# Altium project NNLightSwitcher.PrjPcb (part 4 of 5)

## Sheet NNLightSwitcher_WirelessCharger.SchDoc
size A4
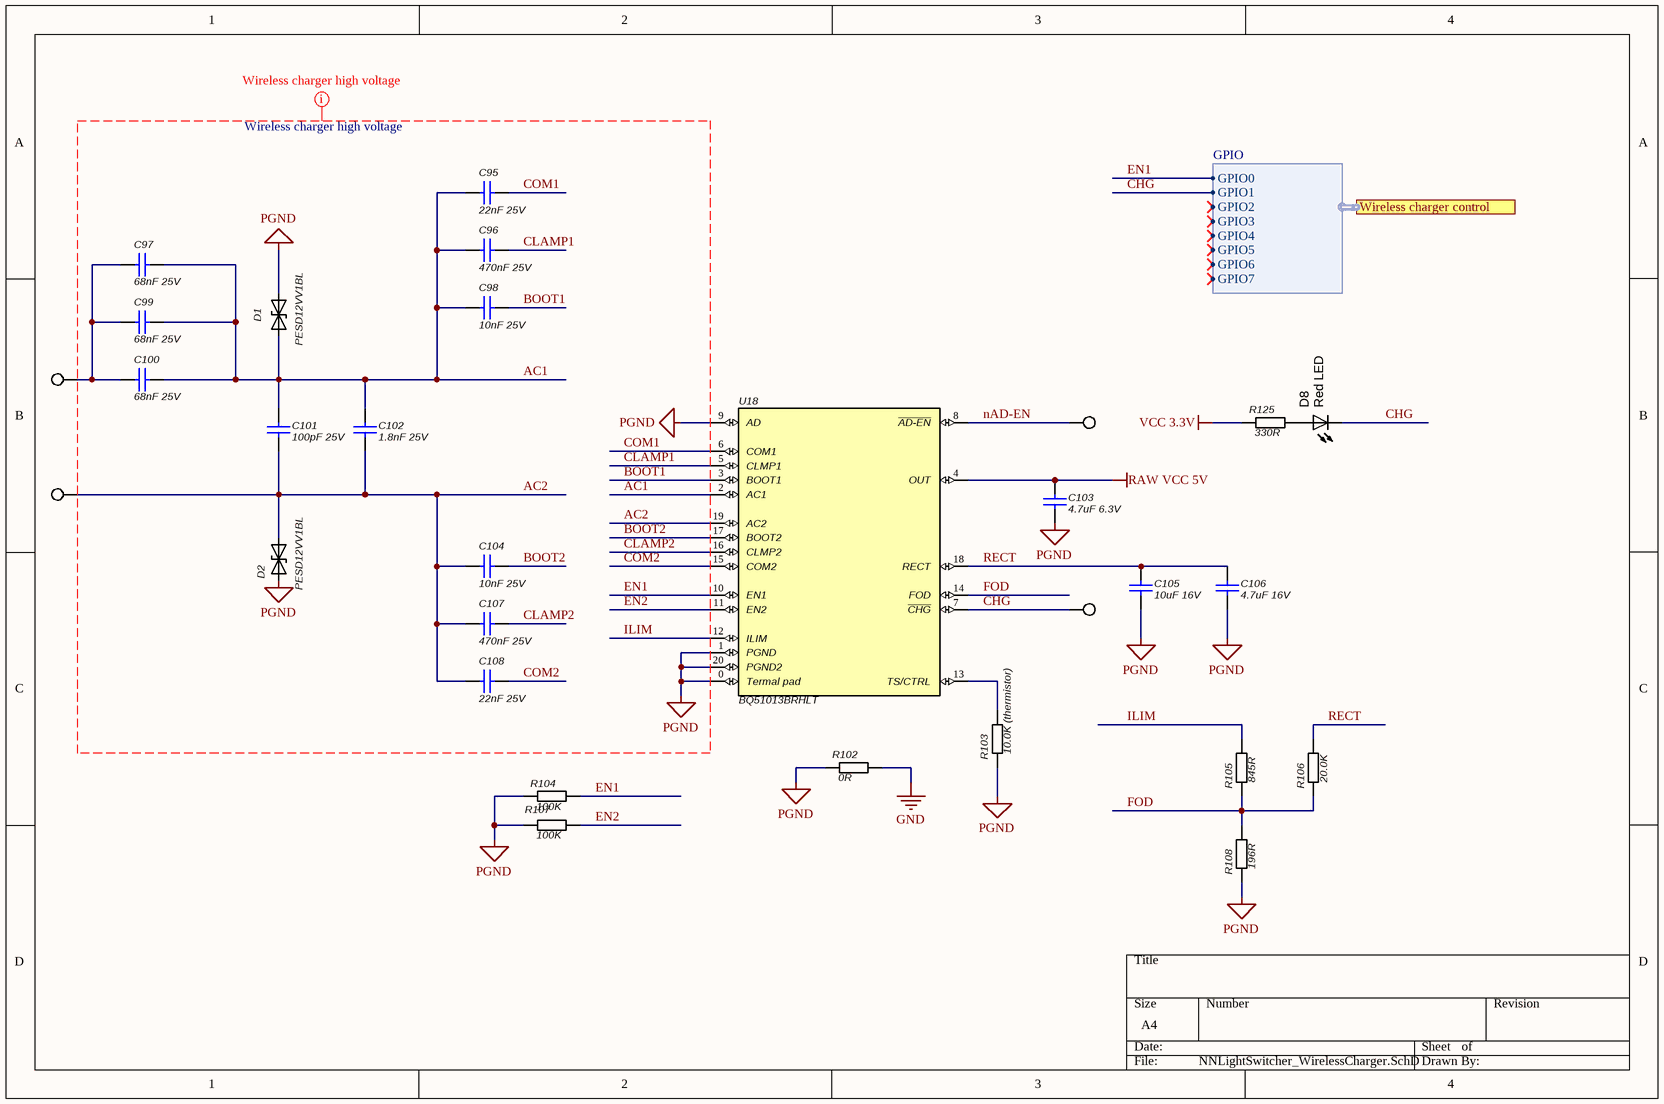
[diagram p11: NNLightSwitcher_WirelessCharger.SchDoc]

### Parts
C95  22nF 25V  [0402]
C96  470nF 25V  [0402]
C97  68nF 25V  [*0603]
C98  10nF 25V  [0402]
C99  68nF 25V  [*0603]
C100  68nF 25V  [*0603]
C101  100pF 25V  [0402]
C102  1.8nF 25V  [0402]
C103  4.7uF 6.3V  [*0603]
C104  10nF 25V  [0402]
C105  10uF 16V  [*0603]
C106  4.7uF 16V  [*0603]
C107  470nF 25V  [0402]
C108  22nF 25V  [0402]
D1  PESD12VV1BL  [*SOD882(T)]
D2  PESD12VV1BL  [*SOD882(T)]
D8  Red LED  [*LED_SML-P11UTT86R_SML-P11MTT86(Primary)]
R102  0R  [0402]
R103  10.0K (thermistor)  [0402]
R104  100K  [0402]
R105  845R  [0402]
R106  20.0K  [0402]
R107  100K  [0402]
R108  196R  [0402]
R125  330R  [0402]
TP56  Test point  [Connection]  (value not drawn)
TP57  Test point  [Testpoint_with_pad]  (value not drawn)
TP58  Test point  [Connection]  (value not drawn)
TP59  Test point  [Testpoint_Keystone_Miniature]  (value not drawn)
U18  BQ51013BRHLT  [*QFN-20(VQFN-20)]

### Ports
Wireless charger control (harness GPIO)

### Harnesses
GPIO: GPIO7, GPIO6, GPIO5, GPIO4, GPIO3, GPIO2, GPIO1, GPIO0

### Nets
GND: R102.2
PGND: C103.2 C105.1 C106.2 D1.1(K) D2.2(A) R102.1 R103.1 R104.1 R107.1 R108.1 U18.0(Termal_pad) U18.1(PGND) U18.9(AD) U18.20(PGND2)
RAW VCC 5V: C103.1 U18.4(OUT)
VCC 3.3V: R125.1
AC1: C95.2 C96.2 C97.1 C98.2 C99.1 C100.1 C101.1 C102.1 D1.2(A) U18.2(AC1)
AC2: C101.2 C102.2 C104.2 C107.2 C108.2 D2.1(K) TP58.1 U18.19(AC2)
BOOT1: C98.1 U18.3(BOOT1)
BOOT2: C104.1 U18.17(BOOT2)
CHG: D8.C TP59.1 U18.7(~{CHG}) ; port Wireless charger control.GPIO1
CLAMP1: C96.1 U18.5(CLMP1)
CLAMP2: C107.1 U18.16(CLMP2)
COM1: C95.1 U18.6(COM1)
COM2: C108.1 U18.15(COM2)
EN1: R104.2 U18.10(EN1) ; port Wireless charger control.GPIO0
EN2: R107.2 U18.11(EN2)
FOD: R105.1 R106.1 R108.2 U18.14(FOD)
ILIM: R105.2 U18.12(ILIM)
nAD-EN: TP57.1 U18.8(~{AD-EN})
RECT: C105.2 C106.1 R106.2 U18.18(RECT)
NetC97_2: C97.2 C99.2 C100.2 TP56.1
NetD8_A: D8.A R125.2
NetR103_2: R103.2 U18.13(TS/CTRL)

### Layout directives
net class Wireless charger high voltage: AC1, AC2, BOOT1, BOOT2, CLAMP1, CLAMP2, COM1, COM2, EN1, EN2, ILIM, PGND

### Library data of the parts
C95 C108 = Capacitor 22nF 25V: GRM155R71E223KA61D; Manufacturer 1: Murata; Tolerance: 10%; Dielectric: X7R; ComponentLink1Description: Datasheet link; ComponentLink1URL: http://www.yageo.com/documents/recent/UPY-GP_NP0_16V-to-50V_16.pdf; Supplier 1: Digi-Key; Manufacturer Part Number 1: GRM155R71E223KA61D; Stock 1: 876310; Pricing 1: 1=0,10000, 10=0,05300, 100=0,02370, 500=0,01690, 1000=0,01328, 2500=0,01208, 5000=0,01111 (USD); RoHS: Yes; Mount: Surface Mount; Case/Package: 0402; Case Code (Metric): 1005; Case Code (Imperial): 0402; Min Operating Temperature: -55°C; Max Operating Temperature: 125°C; Capacitance: 22nF; Packaging: Tape and Reel; Package Quantity: 1; Voltage Rating: 25V; Termination: SMD/SMT; Voltage: 25V; Voltage Rating (DC): 25V; Length: 1mm; Height: 0.5mm; Width: 0.02inch; Thickness: 0.022inch; Depth: 0.5mm; Radiation Hardening: No; REACH SVHC: No SVHC; Lead Free: Lead Free; ComponentLink2URL: https://datasheet.ciiva.com/131/product-131108.pdf?src-supplier=Digi-Key; ComponentLink2Description: https://datasheet.ciiva.com/131/product-131108.pdf?src-supplier=Digi-Key; ComponentLink3URL: https://datasheet.ciiva.com/131/grm155r71e223ka61-01-131110.pdf?src-supplier=Digi-Key; ComponentLink3Description: https://datasheet.ciiva.com/131/grm155r71e223ka61-01-131110.pdf?src-supplier=Digi-Key; ComponentLink4URL: https://datasheet.ciiva.com/18184/getdatasheetpartid-178879-18184701.pdf?src-supplier=Verical; ComponentLink4Description: https://datasheet.ciiva.com/18184/getdatasheetpartid-178879-18184701.pdf?src-supplier=Verical; ComponentLink5URL: https://datasheet.ciiva.com/14103/grmseries-highdielectrictype-eng-14103752.pdf?src-supplier=Distrelec; ComponentLink5Description: https://datasheet.ciiva.com/14103/grmseries-highdielectrictype-eng-14103752.pdf?src-supplier=Distrelec; ComponentLink6URL: https://datasheet.ciiva.com/5414/product-5414091.pdf?src-supplier=Mouser; ComponentLink6Description: https://datasheet.ciiva.com/5414/product-5414091.pdf?src-supplier=Mouser; ComponentLink7URL: https://datasheet.ciiva.com/16396/product-16396813.pdf?src-supplier=Future+Electronics; ComponentLink7Description: https://datasheet.ciiva.com/16396/product-16396813.pdf?src-supplier=Future+Electronics; ComponentLink8URL: https://datasheet.ciiva.com/2989/product-2989390.pdf?src-supplier=Avnet; ComponentLink8Description: https://datasheet.ciiva.com/2989/product-2989390.pdf?src-supplier=Avnet
C96 C107 = Capacitor 470nF 25V: GRM188R71E474KA12D; Manufacturer 1: Murata; Material: Ceramic; Tolerance: 10%; Dielectric: X7R; Voltage: 50V; ComponentLink1Description: Datasheet link; ComponentLink1URL: http://www.yageo.com/documents/recent/UPY-GP_NP0_16V-to-50V_16.pdf; Supplier 1: Digi-Key; Manufacturer Part Number 1: GRM188R71E474KA12D; Stock 1: 3228065; Pricing 1: 1=0,25000, 10=0,16800, 100=0,08520, 500=0,05832, 1000=0,05159 (USD); RoHS: Yes; Mount: Surface Mount; Case/Package: 0603; Number of Pins: 2; Case Code (Metric): 1608; Case Code (Imperial): 0603; Min Operating Temperature: -55°C; Max Operating Temperature: 125°C; Capacitance: 470nF; Packaging: Tape and Reel; Voltage Rating: 25V; Package Quantity: 4000; Voltage Rating (DC): 25V; Termination: SMD/SMT; Length: 1.6mm; Height: 0.8mm; Width: 0.031inch; Thickness: 0.035inch; Depth: 0.8mm; REACH SVHC: No SVHC; Lead Free: Lead Free; ComponentLink2URL: https://datasheet.ciiva.com/16293/grm188r71e474ka12d-16293088.pdf?src-supplier=Future+Electronics; ComponentLink2Description: https://datasheet.ciiva.com/16293/grm188r71e474ka12d-16293088.pdf?src-supplier=Future+Electronics; ComponentLink3URL: https://datasheet.ciiva.com/34302/1857559-34302862.pdf?src-supplier=Jameco; ComponentLink3Description: https://datasheet.ciiva.com/34302/1857559-34302862.pdf?src-supplier=Jameco; ComponentLink4URL: https://datasheet.ciiva.com/7937/1747458-7937650.pdf?src-supplier=Element14; ComponentLink4Description: https://datasheet.ciiva.com/7937/1747458-7937650.pdf?src-supplier=Element14; ComponentLink5URL: https://datasheet.ciiva.com/134/grm188r71e474ka12-01-134310.pdf?src-supplier=Digi-Key; ComponentLink5Description: https://datasheet.ciiva.com/134/grm188r71e474ka12-01-134310.pdf?src-supplier=Digi-Key; ComponentLink6URL: https://datasheet.ciiva.com/29199/454518-da-01-en-vs-kondensator-0603-29199596.pdf?src-supplier=Conrad; ComponentLink6Description: https://datasheet.ciiva.com/29199/454518-da-01-en-vs-kondensator-0603-29199596.pdf?src-supplier=Conrad; ComponentLink7URL: https://datasheet.ciiva.com/22703/1747458-22703340.pdf?src-supplier=Element14; ComponentLink7Description: https://datasheet.ciiva.com/22703/1747458-22703340.pdf?src-supplier=Element14; ComponentLink8URL: https://datasheet.ciiva.com/134/grm188r71e474ka12-01-134309.pdf?src-supplier=Digi-Key; ComponentLink8Description: https://datasheet.ciiva.com/134/grm188r71e474ka12-01-134309.pdf?src-supplier=Digi-Key; ComponentLink9URL: https://datasheet.ciiva.com/134/grm188r71e474ka12-01-134308.pdf?src-supplier=Digi-Key; ComponentLink9Description: https://datasheet.ciiva.com/134/grm188r71e474ka12-01-134308.pdf?src-supplier=Digi-Key
C97 C99 C100 = Capacitor 68nF 25V: CAP CER 0.068UF 25V X7R 0603CC0603KRX7R8BB683; Manufacturer 1: Yageo; Tolerance: 10%; ComponentLink1Description: Datasheet link; ComponentLink1URL: http://www.yageo.com/documents/recent/UPY-GP_NP0_16V-to-50V_16.pdf; Supplier 1: Digi-Key; Manufacturer Part Number 1: CC0603KRX7R8BB683; Stock 1: 55162; Pricing 1: 1=0,11000, 10=0,08400, 100=0,03740, 500=0,02672, 1000=0,02099 (USD); RoHS: Yes; Mount: Surface Mount; Case/Package: 0603; Number of Pins: 2; Weight: 7.1E-05oz; Case Code (Imperial): 0603; Case Code (Metric): 1608; Min Operating Temperature: -55°C; Max Operating Temperature: 125°C; Capacitance: 68nF; Dielectric: X7R; Voltage Rating: 25V; Voltage Rating (DC): 25V; Packaging: Tape and Reel; Termination: SMD/SMT; Composition: Ceramic; Voltage: 25V; Length: 1.6mm; Height: 0.8mm; Width: 0.8mm; Thickness: 0.035inch; Depth: 0.8mm; Radiation Hardening: No; Lead Free: Lead Free; Halogen Free: Halogen Free; ComponentLink2URL: https://datasheet.ciiva.com/11786/0900766b80c10176-11786209.pdf?src-supplier=RSComponents; ComponentLink2Description: https://datasheet.ciiva.com/11786/0900766b80c10176-11786209.pdf?src-supplier=RSComponents; ComponentLink3URL: https://datasheet.ciiva.com/26862/getdatasheetpartid-403581-26862844.pdf?src-supplier=Verical; ComponentLink3Description: https://datasheet.ciiva.com/26862/getdatasheetpartid-403581-26862844.pdf?src-supplier=Verical; ComponentLink4URL: https://datasheet.ciiva.com/11465/upy-gphc-x7r-6-3v-to-50v-8-11465211.pdf?src-supplier=Avnet; ComponentLink4Description: https://datasheet.ciiva.com/11465/upy-gphc-x7r-6-3v-to-50v-8-11465211.pdf?src-supplier=Avnet; ComponentLink5URL: https://datasheet.ciiva.com/17434/upy-gphc-x7r-6-3v-to-50v-8-17434638.pdf?src-supplier=Avnet+Europe; ComponentLink5Description: https://datasheet.ciiva.com/17434/upy-gphc-x7r-6-3v-to-50v-8-17434638.pdf?src-supplier=Avnet+Europe
C98 C104 = Capacitor 10nF 25V: GRM155R71E103KA01D; Manufacturer 1: Murata; Material: Ceramic; Tolerance: 10%; Dielectric: X7R; Insulation Resistance: 10GR; ComponentLink1Description: Datasheet link; ComponentLink1URL: http://www.yageo.com/documents/recent/UPY-GP_NP0_16V-to-50V_16.pdf; Supplier 1: Digi-Key; Manufacturer Part Number 1: GRM155R71E103KA01D; Stock 1: 8764399; Pricing 1: 1=0,10000, 10=0,02900, 100=0,01300, 500=0,00928, 1000=0,00729, 2500=0,00662, 5000=0,00610 (USD); RoHS: Yes; Mount: Surface Mount; Case/Package: 0402; Number of Pins: 2; Case Code (Imperial): 0402; Case Code (Metric): 1005; Dielectric Material: Ceramic; Min Operating Temperature: -55°C; Max Operating Temperature: 125°C; Capacitance: 10nF; Packaging: Tape and Reel; Voltage Rating: 25V; Voltage Rating (DC): 25V; Package Quantity: 1; Termination: SMD/SMT; Voltage: 25V; Length: 1mm; Height: 0.5mm; Width: 0.5mm; Thickness: 0.022inch; Depth: 0.5mm; Radiation Hardening: No; REACH SVHC: No SVHC; Lead Free: Lead Free; ComponentLink2URL: https://datasheet.ciiva.com/11786/0900766b807a1cab-11786320.pdf?src-supplier=RSComponents; ComponentLink2Description: https://datasheet.ciiva.com/11786/0900766b807a1cab-11786320.pdf?src-supplier=RSComponents; ComponentLink3URL: https://datasheet.ciiva.com/18184/getdatasheetpartid-161489-18184689.pdf?src-supplier=Verical; ComponentLink3Description: https://datasheet.ciiva.com/18184/getdatasheetpartid-161489-18184689.pdf?src-supplier=Verical; ComponentLink4URL: https://datasheet.ciiva.com/28534/1699889-28534148.pdf?src-supplier=Element14; ComponentLink4Description: https://datasheet.ciiva.com/28534/1699889-28534148.pdf?src-supplier=Element14; ComponentLink5URL: https://datasheet.ciiva.com/3777/3813grm155r71e103ka0123-3777115.pdf?src-supplier=Arrow; ComponentLink5Description: https://datasheet.ciiva.com/3777/3813grm155r71e103ka0123-3777115.pdf?src-supplier=Arrow; ComponentLink6URL: https://datasheet.ciiva.com/129/partnumbering-e-01-129741.pdf?src-supplier=Digi-Key; ComponentLink6Description: https://datasheet.ciiva.com/129/partnumbering-e-01-129741.pdf?src-supplier=Digi-Key; ComponentLink7URL: https://datasheet.ciiva.com/129/partnumbering-e-01-129742.pdf?src-supplier=Digi-Key; ComponentLink7Description: https://datasheet.ciiva.com/129/partnumbering-e-01-129742.pdf?src-supplier=Digi-Key; ComponentLink8URL: https://datasheet.ciiva.com/129/partnumbering-e-01-129743.pdf?src-supplier=Digi-Key; ComponentLink8Description: https://datasheet.ciiva.com/129/partnumbering-e-01-129743.pdf?src-supplier=Digi-Key; ComponentLink9URL: https://datasheet.ciiva.com/29199/454154-da-01-en-vs-kondensator-0402-29199817.pdf?src-supplier=Conrad; ComponentLink9Description: https://datasheet.ciiva.com/29199/454154-da-01-en-vs-kondensator-0402-29199817.pdf?src-supplier=Conrad; ComponentLink10URL: https://datasheet.ciiva.com/7937/1747448-7937621.pdf?src-supplier=Element14; ComponentLink10Description: https://datasheet.ciiva.com/7937/1747448-7937621.pdf?src-supplier=Element14; ComponentLink11URL: https://datasheet.ciiva.com/16199/product-16199034.pdf?src-supplier=Future+Electronics; ComponentLink11Description: https://datasheet.ciiva.com/16199/product-16199034.pdf?src-supplier=Future+Electronics
C101 = Capacitor 100pF 25V: GRM033R71E101KA01D; Manufacturer 1: Murata; Material: Ceramic; Tolerance: 10%; Dielectric: X7R; ComponentLink1Description: Datasheet link; ComponentLink1URL: http://www.yageo.com/documents/recent/UPY-GP_NP0_16V-to-50V_16.pdf; Supplier 1: Digi-Key; Manufacturer Part Number 1: GRM033R71E101KA01D; Stock 1: 726781; Pricing 1: 1=0,10000, 10=0,02700, 100=0,01190, 500=0,00848, 1000=0,00666, 2500=0,00605, 5000=0,00557 (USD); RoHS: Yes; Mount: Surface Mount; Case/Package: 0201; Case Code (Imperial): 0201; Case Code (Metric): 0603; Min Operating Temperature: -55°C; Max Operating Temperature: 125°C; Capacitance: 100pF; Packaging: Tape and Reel; Voltage Rating: 25V; Voltage Rating (DC): 25V; Package Quantity: 1; Termination: SMD/SMT; Voltage: 25V; Length: 0.6mm; Height: 0.3mm; Width: 0.3mm; Thickness: 0.013inch; Depth: 0.3mm; Radiation Hardening: No; Lead Free: Lead Free; ComponentLink2URL: https://datasheet.ciiva.com/18184/getdatasheetpartid-228478-18184102.pdf?src-supplier=Verical; ComponentLink2Description: https://datasheet.ciiva.com/18184/getdatasheetpartid-228478-18184102.pdf?src-supplier=Verical; ComponentLink3URL: https://datasheet.ciiva.com/129/grm033r71e101ka01-01-129915.pdf?src-supplier=Digi-Key; ComponentLink3Description: https://datasheet.ciiva.com/129/grm033r71e101ka01-01-129915.pdf?src-supplier=Digi-Key; ComponentLink4URL: https://datasheet.ciiva.com/129/grm033r71e101ka01-01-129916.pdf?src-supplier=Digi-Key; ComponentLink4Description: https://datasheet.ciiva.com/129/grm033r71e101ka01-01-129916.pdf?src-supplier=Digi-Key; ComponentLink5URL: https://datasheet.ciiva.com/129/grm033r71e101ka01-01-129917.pdf?src-supplier=Digi-Key; ComponentLink5Description: https://datasheet.ciiva.com/129/grm033r71e101ka01-01-129917.pdf?src-supplier=Digi-Key; ComponentLink6URL: https://datasheet.ciiva.com/29199/455792-da-01-en-vs-kondensator-0201-29199171.pdf?src-supplier=Conrad; ComponentLink6Description: https://datasheet.ciiva.com/29199/455792-da-01-en-vs-kondensator-0201-29199171.pdf?src-supplier=Conrad; ComponentLink7URL: https://datasheet.ciiva.com/11605/product-11605541.pdf?src-supplier=Avnet; ComponentLink7Description: https://datasheet.ciiva.com/11605/product-11605541.pdf?src-supplier=Avnet; ComponentLink8URL: https://datasheet.ciiva.com/16370/product-16370826.pdf?src-supplier=Future+Electronics; ComponentLink8Description: https://datasheet.ciiva.com/16370/product-16370826.pdf?src-supplier=Future+Electronics
C102 = Capacitor 1.8nF 50V: GRM155R71H182KA01D; Manufacturer 1: Murata; Material: Ceramic; Tolerance: 10%; Dielectric: X7R; Voltage Rating: 50V; ComponentLink1Description: Datasheet link; ComponentLink1URL: http://www.yageo.com/documents/recent/UPY-GP_NP0_16V-to-50V_16.pdf; Supplier 1: Digi-Key; Manufacturer Part Number 1: GRM155R71H182KA01D; Stock 1: 1524; Pricing 1: 1=0,10000, 10=0,02900, 100=0,01300, 500=0,00928, 1000=0,00729, 2500=0,00662, 5000=0,00610 (USD); RoHS: Yes; Mount: Surface Mount; Case/Package: 0402; Case Code (Metric): 1005; Case Code (Imperial): 0402; Min Operating Temperature: -55°C; Max Operating Temperature: 125°C; Capacitance: 1.8nF; Package Quantity: 1; Packaging: Tape and Reel; Voltage Rating (DC): 50V; Termination: SMD/SMT; Voltage: 50V; Length: 1mm; Height: 0.5mm; Width: 0.5mm; Thickness: 0.022inch; Depth: 0.5mm; Radiation Hardening: No; REACH SVHC: No SVHC; Lead Free: Lead Free; ComponentLink2URL: https://datasheet.ciiva.com/18184/getdatasheetpartid-199954-18184733.pdf?src-supplier=Verical; ComponentLink2Description: https://datasheet.ciiva.com/18184/getdatasheetpartid-199954-18184733.pdf?src-supplier=Verical; ComponentLink3URL: https://datasheet.ciiva.com/161/partnumbering-e-01-161462.pdf?src-supplier=Digi-Key; ComponentLink3Description: https://datasheet.ciiva.com/161/partnumbering-e-01-161462.pdf?src-supplier=Digi-Key; ComponentLink4URL: https://datasheet.ciiva.com/161/partnumbering-e-01-161463.pdf?src-supplier=Digi-Key; ComponentLink4Description: https://datasheet.ciiva.com/161/partnumbering-e-01-161463.pdf?src-supplier=Digi-Key; ComponentLink5URL: https://datasheet.ciiva.com/161/partnumbering-e-01-161464.pdf?src-supplier=Digi-Key; ComponentLink5Description: https://datasheet.ciiva.com/161/partnumbering-e-01-161464.pdf?src-supplier=Digi-Key; ComponentLink6URL: https://datasheet.ciiva.com/2989/product-2989404.pdf?src-supplier=Avnet; ComponentLink6Description: https://datasheet.ciiva.com/2989/product-2989404.pdf?src-supplier=Avnet; ComponentLink7URL: https://datasheet.ciiva.com/5422/product-5422047.pdf?src-supplier=Mouser; ComponentLink7Description: https://datasheet.ciiva.com/5422/product-5422047.pdf?src-supplier=Mouser
C103 = Capacitor 4.7uF 6.3V: ComponentLink1Description: Datasheet link; ComponentLink1URL: http://www.yageo.com/documents/recent/UPY-GP_NP0_16V-to-50V_16.pdf
C105 = Capacitor 10uF 16V: EMK107BBJ106MA-T; Manufacturer 1: Taiyo Yuden; Tolerance: 20%; Dielectric: X5R; ComponentLink1Description: Datasheet link; ComponentLink1URL: http://www.yageo.com/documents/recent/UPY-GP_NP0_16V-to-50V_16.pdf; Supplier 1: Digi-Key; Manufacturer Part Number 1: EMK107BBJ106MA-T; Stock 1: 576511; Pricing 1: 1=0,44000, 10=0,30600, 100=0,18370, 500=0,13778, 1000=0,11635 (USD); RoHS: Yes; Mount: Surface Mount; Case/Package: 0603; Case Code (Metric): 1608; Case Code (Imperial): 0603; Min Operating Temperature: -55°C; Max Operating Temperature: 85°C; Capacitance: 10uF; Packaging: Tape and Reel; Voltage Rating: 16V; Package Quantity: 1; Termination: SMD/SMT; Voltage Rating (DC): 16V; Length: 0.063inch; Height: 0.8mm; Width: 0.031inch; Thickness: 0.031inch; REACH SVHC: Unknown; Halogen Free: Halogen Free; ComponentLink2URL: https://datasheet.ciiva.com/6259/emk107bbj106ma-t-6259169.pdf?src-supplier=Digi-Key; ComponentLink2Description: https://datasheet.ciiva.com/6259/emk107bbj106ma-t-6259169.pdf?src-supplier=Digi-Key; ComponentLink3URL: https://datasheet.ciiva.com/15920/3emk107bbj106ma-t-15920482.pdf?src-supplier=Onlinecomponents.com; ComponentLink3Description: https://datasheet.ciiva.com/15920/3emk107bbj106ma-t-15920482.pdf?src-supplier=Onlinecomponents.com; ComponentLink4URL: https://datasheet.ciiva.com/34372/463emk107bbj106ma-t-34372674.pdf?src-supplier=Onlinecomponents.com; ComponentLink4Description: https://datasheet.ciiva.com/34372/463emk107bbj106ma-t-34372674.pdf?src-supplier=Onlinecomponents.com; ComponentLink5URL: https://datasheet.ciiva.com/6259/emk107bbj106ma-t-6259164.pdf?src-supplier=Digi-Key; ComponentLink5Description: https://datasheet.ciiva.com/6259/emk107bbj106ma-t-6259164.pdf?src-supplier=Digi-Key; ComponentLink6URL: https://datasheet.ciiva.com/6259/emk107bbj106ma-t-6259167.pdf?src-supplier=Digi-Key; ComponentLink6Description: https://datasheet.ciiva.com/6259/emk107bbj106ma-t-6259167.pdf?src-supplier=Digi-Key; ComponentLink7URL: https://datasheet.ciiva.com/13168/mlcc01-e-13168735.pdf?src-supplier=Mouser; ComponentLink7Description: https://datasheet.ciiva.com/13168/mlcc01-e-13168735.pdf?src-supplier=Mouser
C106 = Capacitor 4.7uF 16V: GRM188R61C475KAAJ; Manufacturer 1: Murata; Manufacturer Part Number 1: GRM188R61C475KAAJD; Material: Ceramic; Tolerance: 10%; Dielectric: X5R; ComponentLink1Description: Datasheet link; ComponentLink1URL: http://www.yageo.com/documents/recent/UPY-GP_NP0_16V-to-50V_16.pdf; Supplier 1: Digi-Key; Stock 1: 258279; Pricing 1: 1=0,35000, 10=0,24600, 100=0,14730, 500=0,11050, 1000=0,09331 (USD); RoHS: Yes; Mount: Surface Mount; Case/Package: 0603; Weight: 0.000222oz; Case Code (Metric): 1608; Case Code (Imperial): 0603; Min Operating Temperature: -55°C; Max Operating Temperature: 85°C; Capacitance: 4.7uF; Voltage Rating (DC): 16V; Packaging: Tape and Reel; Voltage Rating: 16V; Termination: SMD/SMT; Package Quantity: 4000; Length: 1.6mm; Height: 0.8mm; Width: 0.8mm; Thickness: 0.037inch; Depth: 0.8mm; REACH SVHC: No SVHC; Lead Free: Lead Free; ComponentLink2URL: https://datasheet.ciiva.com/14813/595grm188r61c475kaaj23-14813668.pdf?src-supplier=Arrow; ComponentLink2Description: https://datasheet.ciiva.com/14813/595grm188r61c475kaaj23-14813668.pdf?src-supplier=Arrow
D1 D2 = PESD12VV1BL: ESD Suppressor TVS 30KV; Manufacturer 1: Nexperia; Manufacturer Part Number 1: PESD12VV1BL,315; Value: *; ComponentLink1Description: https://assets.nexperia.com/documents/data-sheet/PESD12VV1BL.pdf?src-supplier=Digi-Key; ComponentLink1URL: https://assets.nexperia.com/documents/data-sheet/PESD12VV1BL.pdf?src-supplier=Digi-Key; Manufacturer 2: Nexperia; Manufacturer Part Number 2: PESD12VV1BL,315; Pricing 1: 1=0,38000, 10=0,30400, 100=0,20730, 500=0,15548, 1000=0,11661 (USD); Pricing 2: 1=0,48000, 10=0,34000, 50=0,34000, 100=0,15600, 1000=0,12000, 2500=0,10200, 10000=0,09300, 20000=0,08700, 50000=0,07800, 100000=0,07500 (USD); RoHS: No; Stock 1: 45449; Stock 2: 157674; Supplier 1: Digi-Key; Supplier 2: Mouser; Supplier Part Number 1: 1727-1304-1-ND; Supplier Part Number 2: 771-PESD12VV1BL,315
D8 = APHHS1005SURCK: LED red 0402; Manufacturer 1: Kingbright; Lens Color: Clear; Forward Current: 20mA; Forward Voltage: 1.95V; Luminous Intensity: 220mcd; Viewing Angle: 120°; Lens Style: Clear,Flat; Dominant Wavelength: 630nm; Number of LEDs: 1; Wavelength: 635nm; ComponentLink1URL: https://datasheet.ciiva.com/15198/getdatasheetpartid-569583-15198505.pdf?src-supplier=Verical; ComponentLink1Description: https://datasheet.ciiva.com/15198/getdatasheetpartid-569583-15198505.pdf?src-supplier=Verical; Supplier 1: Digi-Key; Manufacturer Part Number 1: APHHS1005SURCK; Stock 1: 30423; Pricing 1: 1=0,42000, 10=0,30400, 100=0,19820, 500=0,14248, 1000=0,11151 (USD); RoHS: Yes; Mount: Surface Mount; Case/Package: 0402; Number of Pins: 2; Color: Red; Case Code (Metric): 1005; Case Code (Imperial): 0402; Min Operating Temperature: -40°C; Max Operating Temperature: 85°C; Illumination Color: Red; Packaging: Tape and Reel; Package Quantity: 2000; Test Current: 20mA; Length: 1mm; Height: 0.6mm; Width: 0.5mm; Lead Free: Lead Free; ComponentLink2URL: https://datasheet.ciiva.com/2114/aphhs1005surck-2114140.pdf?src-supplier=Digi-Key; ComponentLink2Description: https://datasheet.ciiva.com/2114/aphhs1005surck-2114140.pdf?src-supplier=Digi-Key; ComponentLink3URL: https://datasheet.ciiva.com/4689/aphhs1005surck-32322-4689068.pdf?src-supplier=Mouser; ComponentLink3Description: https://datasheet.ciiva.com/4689/aphhs1005surck-32322-4689068.pdf?src-supplier=Mouser; ComponentLink4URL: https://datasheet.ciiva.com/14603/70062833-14603899.pdf?src-supplier=Allied+Electronics; ComponentLink4Description: https://datasheet.ciiva.com/14603/70062833-14603899.pdf?src-supplier=Allied+Electronics; ComponentLink5URL: https://datasheet.ciiva.com/2114/aphhs1005surck-2114141.pdf?src-supplier=Digi-Key; ComponentLink5Description: https://datasheet.ciiva.com/2114/aphhs1005surck-2114141.pdf?src-supplier=Digi-Key; ComponentLink6URL: https://datasheet.ciiva.com/2114/aphhs1005surck-2114142.pdf?src-supplier=Digi-Key; ComponentLink6Description: https://datasheet.ciiva.com/2114/aphhs1005surck-2114142.pdf?src-supplier=Digi-Key
R102 = Resistor 0R
R103 = Resistor 10.0K: thermistor
R104 R107 = Resistor 100K
R105 = Resistor 845R
R106 = Resistor 20.0K
R108 = Resistor 196R
R125 = Resistor 330R
TP56-TP59 = Test point: Test Point, Miniature, SMT; ComponentLink1Description: Datasheet URL; ComponentLink1URL: http://www.keyelco.com/userAssets/store/files/5015.PDF
U18 = BQ51013BRHLT: WPC 1.1 Compatible Fully Integrated Wireless Power Receiver IC 20-VQFN; Manufacturer 1: Texas Instruments; Operating Supply Current: 8mA; Output Current: 1.5A; Output Voltage: 5V; Min Supply Voltage: 4V; Max Supply Voltage: 10V; Output Power: 5W; Supplier 1: Digi-Key; Stock 1: 2807; Pricing 1: 1=4,02000, 10=3,58800, 25=3,22960, 100=2,94250 (USD); RoHS: Yes; Mount: Surface Mount; Case/Package: VQFN; Number of Pins: 20; Weight: 0.002469oz; Contact Plating: Gold; Min Operating Temperature: -40°C; Max Operating Temperature: 150°C; Packaging: Tape and Reel; Package Quantity: 250; Logic Function: Receiver; Length: 4.65mm; Height: 0.95mm; Width: 3.65mm; Lead Free: Lead Free; REACH SVHC: No SVHC; ComponentLink1URL: https://datasheet.ciiva.com/22691/1726308-22691764.pdf?src-supplier=Element14; ComponentLink1Description: https://datasheet.ciiva.com/22691/1726308-22691764.pdf?src-supplier=Element14; ComponentLink2URL: https://datasheet.ciiva.com/6602/bq51013b-6602581.pdf?src-supplier=Digi-Key; ComponentLink2Description: https://datasheet.ciiva.com/6602/bq51013b-6602581.pdf?src-supplier=Digi-Key; ComponentLink3URL: https://datasheet.ciiva.com/6602/bq51013b-6602582.pdf?src-supplier=Digi-Key; ComponentLink3Description: https://datasheet.ciiva.com/6602/bq51013b-6602582.pdf?src-supplier=Digi-Key; ComponentLink4URL: https://datasheet.ciiva.com/6602/bq51013b-6602583.pdf?src-supplier=Digi-Key; ComponentLink4Description: https://datasheet.ciiva.com/6602/bq51013b-6602583.pdf?src-supplier=Digi-Key; Manufacturer Part Number 1: BQ51013BRHLT

## Sheet NNLightSwitcher_charge.SchDoc
size A4
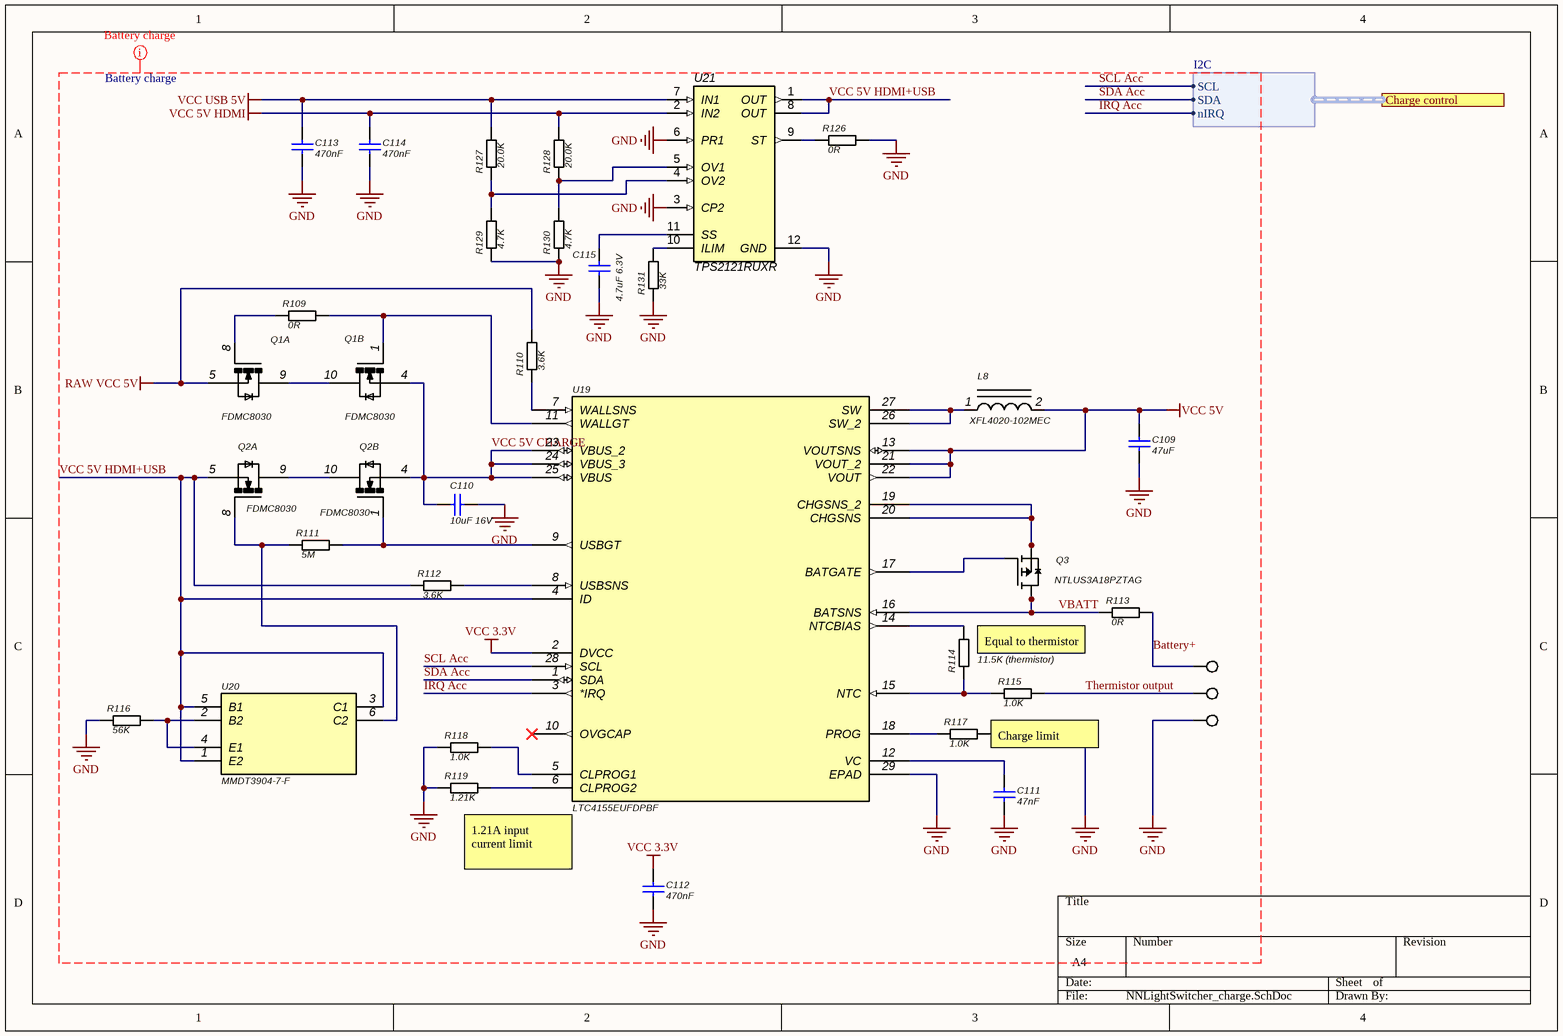
[diagram p12: NNLightSwitcher_charge.SchDoc]

### Parts
C109  47uF  [Res_0805]
C110  10uF 16V  [*0603]
C111  47nF  [0402]
C112  470nF  [0402]
C113  470nF  [0402]
C114  470nF  [0402]
C115  4.7uF 6.3V  [*0603]
L8  XFL4020-102MEC  [*INDM4040X210]
Q1  FDMC8030  [*TRANS_FDMC8030]  (parts A,B of 2)
Q2  FDMC8030  [*TRANS_FDMC8030]  (parts A,B of 2)
Q3  NTLUS3A18PZTAG  [*TRANS_NTLUS3A18PZTAG]
R109  0R  [0402]
R110  3.6K  [0402]
R111  5M  [0402]
R112  3.6K  [0402]
R113  0R  [0402]
R114  11.5K (thermistor)  [0402]
R115  1.0K  [0402]
R116  56K  [0402]
R117  1.0K  [0402]
R118  1.0K  [0402]
R119  1.21K  [0402]
R126  0R  [0402]
R127  20.0K  [0402]
R128  20.0K  [0402]
R129  4.7K  [0402]
R130  4.7K  [0402]
R131  33K  [0402]
TP60  Test point  [Connection]  (value not drawn)
TP61  Test point  [Connection]  (value not drawn)
TP62  Test point  [Connection]  (value not drawn)
U19  LTC4155EUFDPBF  [*QFN-28_UFD]
U20  MMDT3904-7-F  [*SOT65P210X110-6N]
U21  TPS2121RUXR  [*IC_TPS2121RUXR_TPS2121RUXR(Primary)]

### Ports
Charge control (harness I2C)

### Harnesses
I2C: SDA, SCL, nIRQ

### Nets
GND: C109.2 C110.1 C111.2 C112.2 C113.2 C114.2 C115.2 R116.1 R117.2 R118.1 R119.1 R126.2 R129.1 R130.1 R131.1 TP62.1 U19.29(EPAD) U21.3(CP2) U21.6(PR1) U21.12(GND)
RAW VCC 5V: Q1.5(S2) R110.2
VCC 3.3V: C112.1 U19.2(DVCC)
VCC 5V: C109.1 L8.2 U19.13(VOUTSNS) U19.21(VOUT_2) U19.22(VOUT)
VCC 5V HDMI: C114.1 R128.2 U21.2(IN2)
VCC USB 5V: C113.1 R127.2 U21.7(IN1)
Battery+: R113.2 TP60.1
IRQ Acc: U19.3(*IRQ) ; port Charge control.nIRQ  [project net GPIO9]
SCL Acc: U19.28(SCL) ; port Charge control.SCL  [project net Batt charge SCL]
SDA Acc: U19.1(SDA) ; port Charge control.SDA  [project net Batt charge SDA]
Thermistor output: R115.2 TP61.1
VBATT: Q3.1(D) Q3.2(D) Q3.5(D) Q3.6(D) Q3.7(D) R113.1 U19.16(BATSNS)
VCC 5V CHARGE: C110.2 Q1.4(S1) Q2.4(S1) U19.23(VBUS_2) U19.24(VBUS_3) U19.25(VBUS)
VCC 5V HDMI+USB: Q2.5(S2) R112.1 U19.4(ID) U20.1(E2) U20.3(C1) U20.5(B1) U21.1(OUT) U21.8(OUT)
NetC111_1: C111.1 U19.12(VC)
NetC115_1: C115.1 U21.11(SS)
NetL8_1: L8.1 U19.26(SW_2) U19.27(SW)
NetQ1_1: Q1.1(G1) R109.2 U19.11(WALLGT)
NetQ1_8: Q1.8(G2) R109.1
NetQ1_9: Q1.9(D2) Q1.10(D1)
NetQ2_1: Q2.1(G1) R111.2 U19.9(USBGT)
NetQ2_8: Q2.8(G2) R111.1 U20.6(C2)
NetQ2_9: Q2.9(D2) Q2.10(D1)
NetQ3_3: Q3.3(G) U19.17(BATGATE)
NetQ3_4: Q3.4(S) Q3.8(S) U19.19(CHGSNS_2) U19.20(CHGSNS)
NetR110_1: R110.1 U19.7(WALLSNS)
NetR112_2: R112.2 U19.8(USBSNS)
NetR114_1: R114.1 R115.1 U19.15(NTC)
NetR114_2: R114.2 U19.14(NTCBIAS)
NetR116_2: R116.2 U20.2(B2) U20.4(E1)
NetR117_1: R117.1 U19.18(PROG)
NetR118_2: R118.2 U19.5(CLPROG1)
NetR119_2: R119.2 U19.6(CLPROG2)
NetR126_1: R126.1 U21.9(ST)
NetR127_1: R127.1 R129.2 U21.4(OV2)
NetR128_1: R128.1 R130.2 U21.5(OV1)
NetR131_2: R131.2 U21.10(ILIM)

Not connected (* = marked no-connect by the designer): U19 10(OVGCAP)*

### Layout directives
net class Battery charge: Battery+, GND, IRQ Acc, RAW VCC 5V, SCL Acc, SDA Acc, Thermistor output, VBATT, VCC 3.3V, VCC 5V, VCC 5V CHARGE, VCC 5V HDMI, VCC 5V HDMI+USB, VCC USB 5V

### Notes on the sheet
- Current limit
  RILM = 18.7kΩ 5.2A
  RILM = 22.1kΩ 4.5 A
  RILM = 29.8kΩ 3.5 A
  RILM = 44.2kΩ 2.5 A
  RILM = 80kΩ 1.5 A
  RILM < 1kΩ 2.5A
- (near R114) Equal to thermistor
- (near R117) Charge limit
- 1.21A input current limit

### Library data of the parts
C109 = Capacitor 47uF: ComponentLink1Description: Datasheet link; ComponentLink1URL: http://www.yageo.com/documents/recent/UPY-GP_NP0_16V-to-50V_16.pdf
C110 = Capacitor 10uF 16V: as C105 on sheet NNLightSwitcher_WirelessCharger; ComponentLink1Description: Datasheet link; ComponentLink1URL: http://www.yageo.com/documents/recent/UPY-GP_NP0_16V-to-50V_16.pdf; Supplier 1: Digi-Key; Manufacturer Part Number 1: EMK107BBJ106MA-T; Stock 1: 576511; Pricing 1: 1=0,44000, 10=0,30600, 100=0,18370, 500=0,13778, 1000=0,11635 (USD); RoHS: Yes; Mount: Surface Mount; Case/Package: 0603; Case Code (Metric): 1608; Case Code (Imperial): 0603; Min Operating Temperature: -55°C; Max Operating Temperature: 85°C; Capacitance: 10uF; Packaging: Tape and Reel; Voltage Rating: 16V; Package Quantity: 1; Termination: SMD/SMT; Voltage Rating (DC): 16V; Length: 0.063inch; Height: 0.8mm; Width: 0.031inch; Thickness: 0.031inch; REACH SVHC: Unknown; Halogen Free: Halogen Free; ComponentLink2URL: https://datasheet.ciiva.com/6259/emk107bbj106ma-t-6259169.pdf?src-supplier=Digi-Key; ComponentLink2Description: https://datasheet.ciiva.com/6259/emk107bbj106ma-t-6259169.pdf?src-supplier=Digi-Key; ComponentLink3URL: https://datasheet.ciiva.com/15920/3emk107bbj106ma-t-15920482.pdf?src-supplier=Onlinecomponents.com; ComponentLink3Description: https://datasheet.ciiva.com/15920/3emk107bbj106ma-t-15920482.pdf?src-supplier=Onlinecomponents.com; ComponentLink4URL: https://datasheet.ciiva.com/34372/463emk107bbj106ma-t-34372674.pdf?src-supplier=Onlinecomponents.com; ComponentLink4Description: https://datasheet.ciiva.com/34372/463emk107bbj106ma-t-34372674.pdf?src-supplier=Onlinecomponents.com; ComponentLink5URL: https://datasheet.ciiva.com/6259/emk107bbj106ma-t-6259164.pdf?src-supplier=Digi-Key; ComponentLink5Description: https://datasheet.ciiva.com/6259/emk107bbj106ma-t-6259164.pdf?src-supplier=Digi-Key; ComponentLink6URL: https://datasheet.ciiva.com/6259/emk107bbj106ma-t-6259167.pdf?src-supplier=Digi-Key; ComponentLink6Description: https://datasheet.ciiva.com/6259/emk107bbj106ma-t-6259167.pdf?src-supplier=Digi-Key; ComponentLink7URL: https://datasheet.ciiva.com/13168/mlcc01-e-13168735.pdf?src-supplier=Mouser; ComponentLink7Description: https://datasheet.ciiva.com/13168/mlcc01-e-13168735.pdf?src-supplier=Mouser
C111 = Capacitor 47nF: ComponentLink1Description: Datasheet link; ComponentLink1URL: http://www.yageo.com/documents/recent/UPY-GP_NP0_16V-to-50V_16.pdf
C112-C114 = Capacitor 470nF: ComponentLink1Description: Datasheet link; ComponentLink1URL: http://www.yageo.com/documents/recent/UPY-GP_NP0_16V-to-50V_16.pdf
C115 = Capacitor 4.7uF 6.3V: ComponentLink1Description: Datasheet link; ComponentLink1URL: http://www.yageo.com/documents/recent/UPY-GP_NP0_16V-to-50V_16.pdf
L8 = XFL4020-102MEC: Power inductor, shielded, 20% tol, SMT, RoHS, halogen free; Manufacturer 1: Coilcraft; Core Material: Composite; DC Resistance (DCR): 11.9mR; Inductance: 1uH; Max DC Current: 11A; Saturation Current: 4.5A; Self Resonant Frequency: 64MHz; Test Frequency: 100kHz; Value: *; Case/Package: SMD/SMT; ComponentLink1Description: https://datasheet.ciiva.com/22679/1682010-22679273.pdf?src-supplier=Element14; ComponentLink1URL: https://datasheet.ciiva.com/22679/1682010-22679273.pdf?src-supplier=Element14; ComponentLink2Description: https://datasheet.ciiva.com/22679/1682010-22679274.pdf?src-supplier=Element14; ComponentLink2URL: https://datasheet.ciiva.com/22679/1682010-22679274.pdf?src-supplier=Element14; ComponentLink3Description: https://datasheet.ciiva.com/13168/xfl4020-13168079.pdf?src-supplier=Mouser; ComponentLink3URL: https://datasheet.ciiva.com/13168/xfl4020-13168079.pdf?src-supplier=Mouser; Height: 2.1mm; Inductance Tolerance: 20%; Lead Free: Contains Lead; Length: 4.3mm; Manufacturer Part Number 1: XFL4020-102MEC; Max Operating Temperature: 125°C; Min Operating Temperature: -40°C; Mount: Surface Mount; Packaging: Tape and Reel; Pricing 1: 1=2,13000, 10=2,13000, 50=1,85000, 100=1,55000, 500=0,96000, 1000=0,88400, 2000=0,82300, 10000=0,82300 (USD); REACH SVHC: No SVHC; RMS Current (Irms): 11A; RoHS: Yes; Shielding: Shielded; Stock 1: 16834; Supplier 1: Mouser; Supplier Part Number 1: 994-XFL4020-102MEC; Termination: SMD/SMT; Tolerance: 20%; Width: 4.3mm
Q1 Q2 = FDMC8030: Mosfet Array 2 N-Channel (Dual) 40V 12A 800mW Surface Mount 8-Power33 (3x3); Manufacturer 1: ON Semiconductor / Fairchild; Drain to Source Resistance: 10mR; Fall Time: 3ns; Gate to Source Voltage (Vgs): 12V; Input Capacitance: 1.975nF; Number of Elements: 1; Turn-Off Delay Time: 19ns; Turn-On Delay Time: 7ns; Value: *; ComponentLink1Description: https://datasheet.ciiva.com/11175/fdmc8030-11175489.pdf?src-supplier=Avnet; ComponentLink1URL: https://datasheet.ciiva.com/11175/fdmc8030-11175489.pdf?src-supplier=Avnet; ComponentLink2Description: https://datasheet.ciiva.com/4439/fdmc8030-103806-4439986.pdf?src-supplier=Mouser; ComponentLink2URL: https://datasheet.ciiva.com/4439/fdmc8030-103806-4439986.pdf?src-supplier=Mouser; ComponentLink3Description: https://datasheet.ciiva.com/15044/fdmc8030-15044346.pdf?src-supplier=Digi-Key; ComponentLink3URL: https://datasheet.ciiva.com/15044/fdmc8030-15044346.pdf?src-supplier=Digi-Key; Continuous Drain Current (ID): 12A; Drain to Source Breakdown Voltage: 40V; Drain to Source Voltage (Vdss): 40V; Element Configuration: Dual; FET Type: 2 N-Channel; Height: 0.75mm; Length: 3mm; Manufacturer Part Number 1: FDMC8030; Max Operating Temperature: 150°C; Max Power Dissipation: 800mW; Min Operating Temperature: -55°C; Mount: Surface Mount; Number of Pins: 8; Package Quantity: 3000; Packaging: Tape and Reel; Power Dissipation: 800mW; Pricing 1: 1=0,85000, 10=0,72800, 50=0,72800, 100=0,56000, 500=0,49500, 1000=0,39000, 3000=0,34600, 9000=0,33300, 10000=0,33300, 24000=0,32300, 45000=0,31300 (USD); Radiation Hardening: No; Rds On Max: 10mR; Rise Time: 3ns; RoHS: Yes; Stock 1: 20975; Supplier 1: Mouser; Supplier Part Number 1: 512-FDMC8030; Weight: 0.196g; Width: 3mm
Q3 = NTLUS3A18PZTAG: Power MOSFET -20V -8.2A 18 mOhm Single P-Channel UDFN6 with ESD Protection; Manufacturer 1: ON Semiconductor; Continuous Drain Current (ID): 8.2A; Drain to Source Resistance: 90mR; Drain to Source Voltage (Vdss): 20V; Fall Time: 88ns; Gate to Source Voltage (Vgs): 8V; Input Capacitance: 2.24nF; Max Power Dissipation: 700mW; Number of Elements: 1; Power Dissipation: 1.7W; Rds On Max: 18mR; Rise Time: 15ns; Turn-Off Delay Time: 150ns; Turn-On Delay Time: 8.6ns; Value: *; ComponentLink1Description: https://datasheet.ciiva.com/13052/ntlus3a18pz-d-89517-13052585.pdf?src-supplier=Mouser; ComponentLink1URL: https://datasheet.ciiva.com/13052/ntlus3a18pz-d-89517-13052585.pdf?src-supplier=Mouser; ComponentLink2Description: https://datasheet.ciiva.com/11166/ntlus3a18pz-d-11166499.pdf?src-supplier=Avnet; ComponentLink2URL: https://datasheet.ciiva.com/11166/ntlus3a18pz-d-11166499.pdf?src-supplier=Avnet; ComponentLink3Description: https://datasheet.ciiva.com/6374/ntlus3a18pz-d-6374085.pdf?src-supplier=Digi-Key; ComponentLink3URL: https://datasheet.ciiva.com/6374/ntlus3a18pz-d-6374085.pdf?src-supplier=Digi-Key; ComponentLink4Description: https://datasheet.ciiva.com/30480/0900766b81267308-30480122.pdf?src-supplier=RSComponents; ComponentLink4URL: https://datasheet.ciiva.com/30480/0900766b81267308-30480122.pdf?src-supplier=RSComponents; Contact Plating: Tin,Matte; Drain to Source Breakdown Voltage: -20V; Element Configuration: Single; Height: 0.5mm; Lead Free: Lead Free; Length: 2mm; Manufacturer 2: ON Semiconductor; Manufacturer Part Number 1: NTLUS3A18PZTAG; Manufacturer Part Number 2: NTLUS3A18PZTAG; Max Operating Temperature: 150°C; Min Operating Temperature: -55°C; Number of Pins: 6; Package Quantity: 3000; Packaging: Tape and Reel; Pricing 1: 1=0,61000, 10=0,53500, 100=0,41040, 500=0,32446, 1000=0,25956 (USD); Pricing 2: 1=0,56000, 10=0,46500, 50=0,46500, 100=0,30000, 1000=0,24000, 10000=0,19600 (USD); Radiation Hardening: No; RoHS: Yes; Stock 1: 1739; Stock 2: 5542; Supplier 1: Digi-Key; Supplier 2: Mouser; Supplier Part Number 1: NTLUS3A18PZTAGOSCT-ND; Supplier Part Number 2: 863-NTLUS3A18PZTAG; Width: 2mm
R109 R111 R113 R126 = Resistor 0R
R110 R112 = Resistor 3.6K
R114 = Resistor 11.5K
R115 R117 R118 = Resistor 1.0K
R116 = Resistor 56K
R119 = Resistor 1.21K
R127 R128 = Resistor 20.0K
R129 R130 = Resistor 4.7K
R131 = Resistor 33K
TP60-TP62 = Test point: Test Point, Miniature, SMT; ComponentLink1Description: Datasheet URL; ComponentLink1URL: http://www.keyelco.com/userAssets/store/files/5015.PDF
U19 = LTC4155EUFDPBF: LTC4155 - Dual Input Power Manager/ 3.5A Li-Ion Battery Charger with I2C Control and USB OTG; Manufacturer 1: Analog Devices / Linear Technology; Manufacturer Part Number 1: LTC4155EUFD#PBF; Max Input Voltage: 5.5V; Min Input Voltage: 4.35V; Number of Cells: 1; Number of Outputs: 2; Value: *; Case/Package: QFN; ComponentLink1Description: https://datasheet.ciiva.com/1140/1712322-1140048.pdf?src-supplier=Farnell; ComponentLink1URL: https://datasheet.ciiva.com/1140/1712322-1140048.pdf?src-supplier=Farnell; ComponentLink2Description: https://datasheet.ciiva.com/1145/1563219-1145027.pdf?src-supplier=Newark; ComponentLink2URL: https://datasheet.ciiva.com/1145/1563219-1145027.pdf?src-supplier=Newark; ComponentLink3Description: https://datasheet.ciiva.com/15114/getdatasheetpartid-472825-15114764.pdf?src-supplier=Verical; ComponentLink3URL: https://datasheet.ciiva.com/15114/getdatasheetpartid-472825-15114764.pdf?src-supplier=Verical; ComponentLink4Description: https://datasheet.ciiva.com/1137/1712322-1137501.pdf?src-supplier=Element14; ComponentLink4URL: https://datasheet.ciiva.com/1137/1712322-1137501.pdf?src-supplier=Element14; ComponentLink5Description: https://datasheet.ciiva.com/1934/39952-1934203.pdf?src-supplier=Digi-Key; ComponentLink5URL: https://datasheet.ciiva.com/1934/39952-1934203.pdf?src-supplier=Digi-Key; Lead Free: Lead Free; Length: 5mm; Max Charge Current: 3.5A; Max Operating Temperature: 125°C; Max Supply Voltage: 5.5V; Min Operating Temperature: -40°C; Min Supply Voltage: 4.35V; Number of Pins: 28; Output Voltage: 4.35V; Package Quantity: 73; Packaging: Rail/Tube; Pricing 1: 1=7,14000, 25=4,74080, 100=3,92000, 250=3,72400, 500=3,64000 (USD); Radiation Hardening: No; REACH SVHC: No SVHC; RoHS: Yes; Stock 1: 2605; Supplier 1: Digi-Key; Supplier Part Number 1: LTC4155EUFD#PBF-ND
U20 = MMDT3904-7-F: TRANSISTOR, ARRAY, DUAL NPN, 40V, 200mA, SOT-363-6, FULL REEL; Manufacturer 1: Diodes; Collector Base Voltage (VCBO): 60V; Collector Emitter Saturation Voltage: 300mV; Emitter Base Voltage (VEBO): 6V; Frequency: 300MHz; hFE Min: 100; Max Power Dissipation: 200mW; Number of Elements: 2; Turn-Off Delay Time: 250ns; Turn-On Delay Time: 70ns; Value: *; Case/Package: SOT-363; Collector Emitter Breakdown Voltage: 40V; Collector Emitter Voltage (VCEO): 40V; ComponentLink1Description: https://datasheet.ciiva.com/11198/ds30088-11198646.pdf?src-supplier=Avnet; ComponentLink1URL: https://datasheet.ciiva.com/11198/ds30088-11198646.pdf?src-supplier=Avnet; ComponentLink2Description: https://datasheet.ciiva.com/15138/getdatasheetpartid-35717-15138590.pdf?src-supplier=Verical; ComponentLink2URL: https://datasheet.ciiva.com/15138/getdatasheetpartid-35717-15138590.pdf?src-supplier=Verical; ComponentLink3Description: https://datasheet.ciiva.com/34302/1591025-34302607.pdf?src-supplier=Jameco; ComponentLink3URL: https://datasheet.ciiva.com/34302/1591025-34302607.pdf?src-supplier=Jameco; ComponentLink4Description: https://datasheet.ciiva.com/4723/ds30088-4723579.pdf?src-supplier=Mouser; ComponentLink4URL: https://datasheet.ciiva.com/4723/ds30088-4723579.pdf?src-supplier=Mouser; ComponentLink5Description: https://datasheet.ciiva.com/8029/ds30088-8029724.pdf?src-supplier=Element14; ComponentLink5URL: https://datasheet.ciiva.com/8029/ds30088-8029724.pdf?src-supplier=Element14; ComponentLink6Description: https://datasheet.ciiva.com/11207/ds30088-11207885.pdf?src-supplier=Avnet; ComponentLink6URL: https://datasheet.ciiva.com/11207/ds30088-11207885.pdf?src-supplier=Avnet; Continuous Collector Current: 200mA; Current Rating: 200mA; Element Configuration: Dual; Gain Bandwidth Product: 300MHz; Height: 1mm; Lead Free: Lead Free; Length: 2.2mm; Manufacturer 2: Diodes; Manufacturer Part Number 1: MMDT3904-7-F; Manufacturer Part Number 2: MMDT3904-7-F; Max Breakdown Voltage: 40V; Max Collector Current: 200mA; Max Frequency: 300MHz; Max Operating Temperature: 150°C; Min Operating Temperature: -55°C; Mount: Surface Mount; Number of Pins: 6; Number of Terminals: 6; Package Quantity: 1; Packaging: Tape and Reel; Polarity: NPN; Power Dissipation: 200mW; Pricing 1: 1=0,28000, 10=0,23300, 100=0,12330, 500=0,08112, 1000=0,05516 (USD); Pricing 2: 1=0,36000, 10=0,25500, 50=0,25500, 100=0,11800, 1000=0,09000, 3000=0,07700, 9000=0,07000, 10000=0,07000, 24000=0,06600 (USD); Radiation Hardening: No; REACH SVHC: No SVHC; RoHS: Yes; Stock 1: 128767; Stock 2: 36237; Supplier 1: Digi-Key; Supplier 2: Mouser; Supplier Part Number 1: MMDT3904-FDICT-ND; Supplier Part Number 2: 621-MMDT3904-F; Transition Frequency: 300MHz; Voltage Rating (DC): 40V; Weight: 0.000212oz; Width: 1.35mm
U21 = TPS2121RUXR: PWR MGMT BATTERY MGMT; MF: Texas Instruments; MP: TPS2121RUXR; Package: VFQFN-12 Texas Instruments; SnapEDA_Link: https://www.snapeda.com/parts/TPS2121RUXR/Texas%20Instruments/view-part/?ref=snap; Availability: Unavailable; Price: None; Value: *